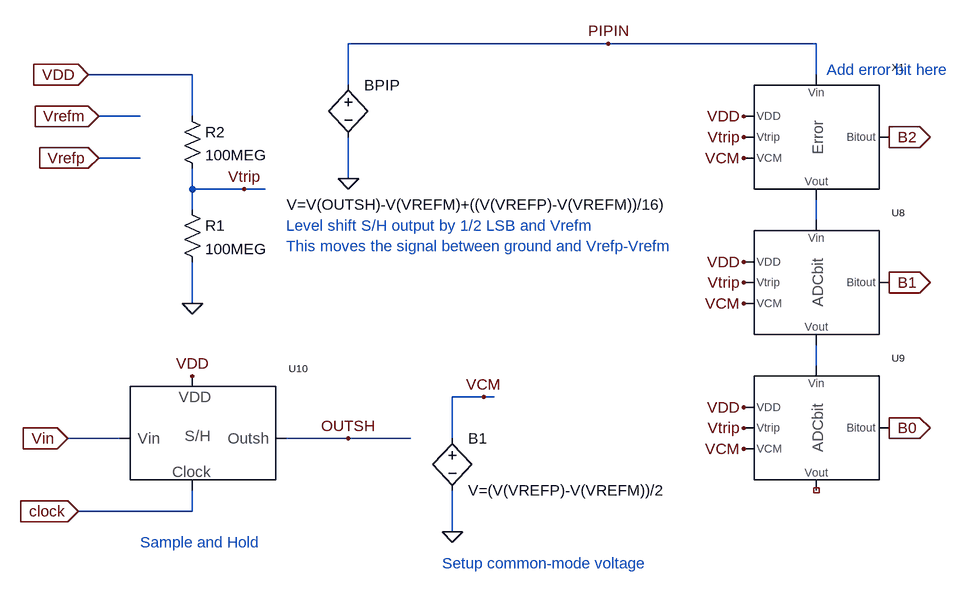
[diagram p0: schematic Error_3_bit_ADC.asc]
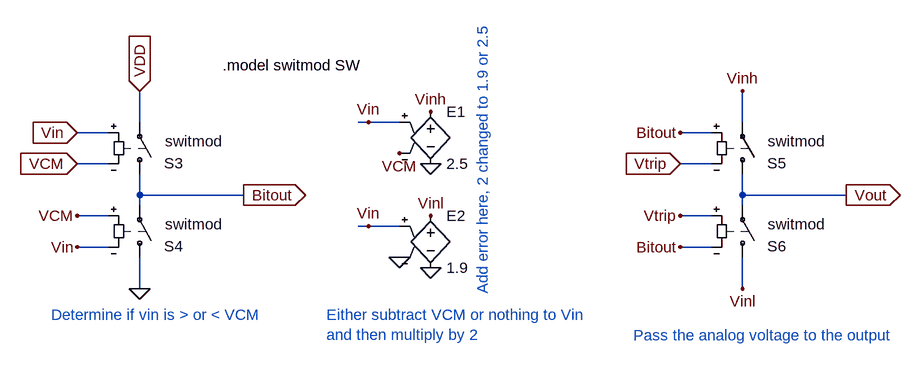
[diagram p1: sub-circuit error_adcbit.asc]
Error_3_bit_ADC.asc, the LTspice schematic file:
Version 4
SHEET 1 2740 696
WIRE 1072 -1104 672 -1104
WIRE 1392 -1104 1072 -1104
WIRE 432 -1056 272 -1056
WIRE 1392 -1056 1392 -1104
WIRE 672 -1040 672 -1104
WIRE 352 -992 288 -992
WIRE 432 -992 432 -1056
WIRE 352 -928 288 -928
WIRE 672 -896 672 -960
WIRE 432 -880 432 -912
WIRE 512 -880 432 -880
WIRE 544 -880 512 -880
WIRE 432 -848 432 -880
WIRE 1392 -832 1392 -864
WIRE 432 -704 432 -768
WIRE 1392 -608 1392 -640
WIRE 880 -560 832 -560
WIRE 896 -560 880 -560
WIRE 320 -496 240 -496
WIRE 672 -496 576 -496
WIRE 768 -496 672 -496
WIRE 832 -496 832 -560
WIRE 432 -384 432 -416
WIRE 432 -384 256 -384
WIRE 832 -352 832 -416
FLAG 256 -384 clock
IOPIN 256 -384 In
FLAG 672 -496 OUTSH
FLAG 512 -880 Vtrip
FLAG 432 -704 0
FLAG 272 -1056 VDD
IOPIN 272 -1056 In
FLAG 240 -496 Vin
IOPIN 240 -496 In
FLAG 832 -352 0
FLAG 880 -560 VCM
FLAG 672 -896 0
FLAG 1280 -960 Vtrip
FLAG 1280 -992 VDD
FLAG 1280 -928 VCM
FLAG 1504 -960 B2
IOPIN 1504 -960 Out
FLAG 1280 -736 Vtrip
FLAG 1280 -768 VDD
FLAG 1280 -704 VCM
FLAG 1504 -736 B1
IOPIN 1504 -736 Out
FLAG 1280 -512 Vtrip
FLAG 1280 -544 VDD
FLAG 1280 -480 VCM
FLAG 1504 -512 B0
IOPIN 1504 -512 Out
FLAG 1072 -1104 PIPIN
FLAG 288 -992 Vrefm
IOPIN 288 -992 In
FLAG 288 -928 Vrefp
IOPIN 288 -928 In
FLAG 432 -592 VDD
SYMBOL res 416 -864 R0
SYMATTR InstName R1
SYMATTR Value 100MEG
SYMBOL res 416 -1008 R0
SYMATTR InstName R2
SYMATTR Value 100MEG
SYMBOL bv 832 -512 R0
SYMATTR InstName B1
SYMATTR Value V=(V(VREFP)-V(VREFM))/2
SYMBOL bv 672 -1056 R0
WINDOW 3 -95 200 Left 0
SYMATTR Value V=V(OUTSH)-V(VREFM)+((V(VREFP)-V(VREFM))/16)
SYMATTR InstName BPIP
SYMBOL ADCbit 1248 -720 R0
SYMATTR InstName U8
SYMBOL ADCbit 1248 -496 R0
SYMATTR InstName U9
SYMBOL Sample_and_hold 336 -432 R0
SYMATTR InstName U10
SYMBOL Error_ADCbit 1248 -944 R0
SYMATTR InstName X1
TEXT 352 -336 Left 0 ;Sample and Hold
TEXT 576 -824 Left 0 ;Level shift S/H output by 1/2 LSB and Vrefm
TEXT 816 -304 Left 0 ;Setup common-mode voltage
TEXT 576 -792 Left 0 ;This moves the signal between ground and Vrefp-Vrefm
TEXT 1408 -1064 Left 0 ;Add error bit here

error_adcbit.asc, the sub-circuit schematic file:
Version 4
SHEET 1 2740 696
WIRE 1136 -960 1136 -1008
WIRE 1488 -960 1472 -960
WIRE 1536 -960 1488 -960
WIRE 2064 -960 2064 -1008
WIRE 1088 -944 1040 -944
WIRE 2016 -944 1968 -944
WIRE 1088 -896 1040 -896
WIRE 2016 -896 1968 -896
WIRE 1136 -848 1136 -880
WIRE 1296 -848 1136 -848
WIRE 2064 -848 2064 -880
WIRE 2224 -848 2064 -848
WIRE 1136 -832 1136 -848
WIRE 2064 -832 2064 -848
WIRE 1088 -816 1040 -816
WIRE 2016 -816 1968 -816
WIRE 1488 -800 1472 -800
WIRE 1536 -800 1488 -800
WIRE 1088 -768 1040 -768
WIRE 2016 -768 1968 -768
WIRE 1136 -704 1136 -752
WIRE 2064 -704 2064 -752
FLAG 1040 -944 Vin
IOPIN 1040 -944 In
FLAG 1040 -896 VCM
IOPIN 1040 -896 In
FLAG 1040 -816 VCM
FLAG 1040 -768 Vin
FLAG 1296 -848 Bitout
IOPIN 1296 -848 Out
FLAG 1136 -704 0
FLAG 1136 -1008 VDD
IOPIN 1136 -1008 In
FLAG 1968 -944 Bitout
FLAG 1968 -896 Vtrip
IOPIN 1968 -896 In
FLAG 1968 -816 Vtrip
FLAG 1968 -768 Bitout
FLAG 2224 -848 Vout
IOPIN 2224 -848 Out
FLAG 1584 -896 0
FLAG 1584 -736 0
FLAG 1584 -976 Vinh
FLAG 1584 -816 Vinl
FLAG 1536 -752 0
FLAG 1536 -912 VCM
FLAG 1488 -960 Vin
FLAG 1488 -800 Vin
FLAG 2064 -1008 Vinh
FLAG 2064 -704 Vinl
SYMBOL sw 1136 -864 M180
WINDOW 3 24 -12 Left 0
WINDOW 38 39 67 Left 0
WINDOW 0 38 33 Left 0
SYMATTR Value ""
SYMATTR SpiceModel switmod
SYMATTR InstName S3
SYMBOL sw 1136 -736 M180
WINDOW 3 24 -12 Left 0
WINDOW 38 39 67 Left 0
WINDOW 0 38 33 Left 0
SYMATTR Value ""
SYMATTR SpiceModel switmod
SYMATTR InstName S4
SYMBOL sw 2064 -864 M180
WINDOW 3 24 -12 Left 0
WINDOW 38 39 67 Left 0
WINDOW 0 38 33 Left 0
SYMATTR Value ""
SYMATTR SpiceModel switmod
SYMATTR InstName S5
SYMBOL sw 2064 -736 M180
WINDOW 3 24 -12 Left 0
WINDOW 38 39 67 Left 0
WINDOW 0 38 33 Left 0
SYMATTR Value ""
SYMATTR SpiceModel switmod
SYMATTR InstName S6
SYMBOL e 1584 -992 R0
SYMATTR InstName E1
SYMATTR Value 2.5
SYMBOL e 1584 -832 R0
SYMATTR InstName E2
SYMATTR Value 1.9
TEXT 1000 -664 Left 0 ;Determine if vin is > or < VCM
TEXT 1424 -664 Left 0 ;Either subtract VCM or nothing to Vin\nand then multiply by 2
TEXT 1896 -632 Left 0 ;Pass the analog voltage to the output
TEXT 1264 -1048 Left 0 !.model switmod SW
TEXT 1664 -696 VLeft 0 ;Add error here, 2 changed to 1.9 or 2.5

The netlist it stands for:
* Error_3_bit_ADC.asc
R1 Vtrip 0 100MEG
R2 VDD Vtrip 100MEG
B1 VCM 0 V=(V(VREFP)-V(VREFM))/2
BPIP PIPIN 0 V=V(OUTSH)-V(VREFM)+((V(VREFP)-V(VREFM))/16)
XU8 VDD Vtrip VCM N001 B1 N002 ADCbit  ; pins VDD Vtrip VCM Vin Bitout Vout
XU9 VDD Vtrip VCM N002 B0 NC_01 ADCbit  ; pins VDD Vtrip VCM Vin Bitout Vout
XU10 Vin OUTSH clock VDD Sample_and_hold  ; pins Vin Outsh Clock VDD
XX1 VDD Vtrip VCM PIPIN B2 N001 error_adcbit

* block symbol definitions
.subckt error_adcbit VDD Vtrip VCM Vin Bitout Vout
S3 Bitout VDD Vin VCM switmod
S4 0 Bitout VCM Vin switmod
S5 Vout Vinh Bitout Vtrip switmod
S6 Vinl Vout Vtrip Bitout switmod
E1 Vinh 0 Vin VCM 2.5
E2 Vinl 0 Vin 0 1.9
* Determine if vin is > or < VCM
* Either subtract VCM or nothing to Vin
* and then multiply by 2
* Pass the analog voltage to the output
.model switmod SW
* Add error here, 2 changed to 1.9 or 2.5
.ends error_adcbit

* Sample and Hold
* Level shift S/H output by 1/2 LSB and Vrefm
* Setup common-mode voltage
* This moves the signal between ground and Vrefp-Vrefm
* Add error bit here
.backanno
.end